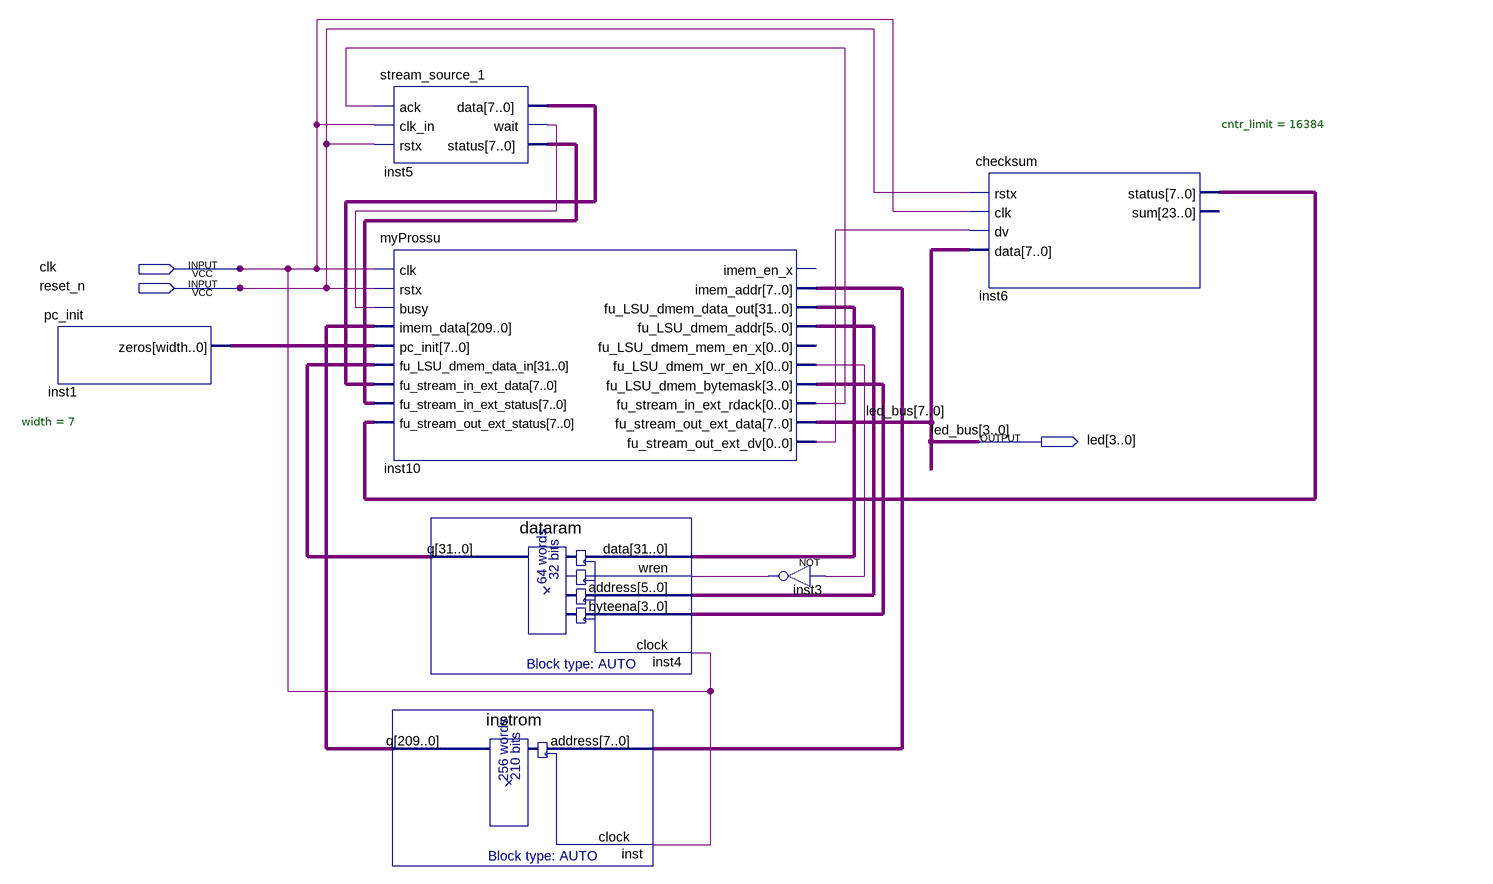
[diagram p0: schematic sheet]
// Quartus schematic tta.bdf as structural Verilog: 7 symbols, 3 pins
module tta (
  input  clk,
  input  reset_n,
  output [3:0] led
);

  wire inst3_out, inst5_wait, inst10_fu_lsu_dmem_wr_en_x, inst10_fu_stream_in_ext_rdack,
       inst10_fu_stream_out_ext_dv;
  wire [3:0] inst10_fu_lsu_dmem_bytemask;
  wire [5:0] inst10_fu_lsu_dmem_addr;
  wire [7:0] inst1_zeros, inst5_data, inst5_status, inst6_status, inst10_imem_addr;
  wire [7:4] led_bus;
  wire [31:0] inst4_q, inst10_fu_lsu_dmem_data_out;
  wire [209:0] inst_q;

  pc_init #(.width(7)) inst1 (.zeros(inst1_zeros));
  stream_source_1 inst5 (
    .ack(inst10_fu_stream_in_ext_rdack), .clk_in(clk), .rstx(reset_n), .data(inst5_data),
    .\wait (inst5_wait), .status(inst5_status));
  myProssu inst10 (
    .clk(clk), .rstx(reset_n), .busy(inst5_wait), .imem_data(inst_q), .pc_init(inst1_zeros),
    .fu_LSU_dmem_data_in(inst4_q), .fu_stream_in_ext_data(inst5_data),
    .fu_stream_in_ext_status(inst5_status), .fu_stream_out_ext_status(inst6_status),
    .imem_addr(inst10_imem_addr), .fu_LSU_dmem_data_out(inst10_fu_lsu_dmem_data_out),
    .fu_LSU_dmem_addr(inst10_fu_lsu_dmem_addr), .fu_LSU_dmem_wr_en_x(inst10_fu_lsu_dmem_wr_en_x),
    .fu_LSU_dmem_bytemask(inst10_fu_lsu_dmem_bytemask),
    .fu_stream_in_ext_rdack(inst10_fu_stream_in_ext_rdack), .fu_stream_out_ext_data({led_bus, led}),
    .fu_stream_out_ext_dv(inst10_fu_stream_out_ext_dv));  // open: imem_en_x, fu_LSU_dmem_mem_en_x
  instrom inst (.address(inst10_imem_addr), .clock(clk), .q(inst_q));
  dataram inst4 (
    .data(inst10_fu_lsu_dmem_data_out), .wren(inst3_out), .address(inst10_fu_lsu_dmem_addr),
    .byteena(inst10_fu_lsu_dmem_bytemask), .clock(clk), .q(inst4_q));
  not inst3 (inst3_out, inst10_fu_lsu_dmem_wr_en_x);
  checksum #(.cntr_limit(16384)) inst6 (
    .rstx(reset_n), .clk(clk), .dv(inst10_fu_stream_out_ext_dv), .data({led_bus, led}), .status(inst6_status));  // open: sum

  // Other names for the same wires on the sheet: led_bus[3:0] = led
endmodule
